# EAGLE design Monlock5x7_B (EAGLE 7.2.0)
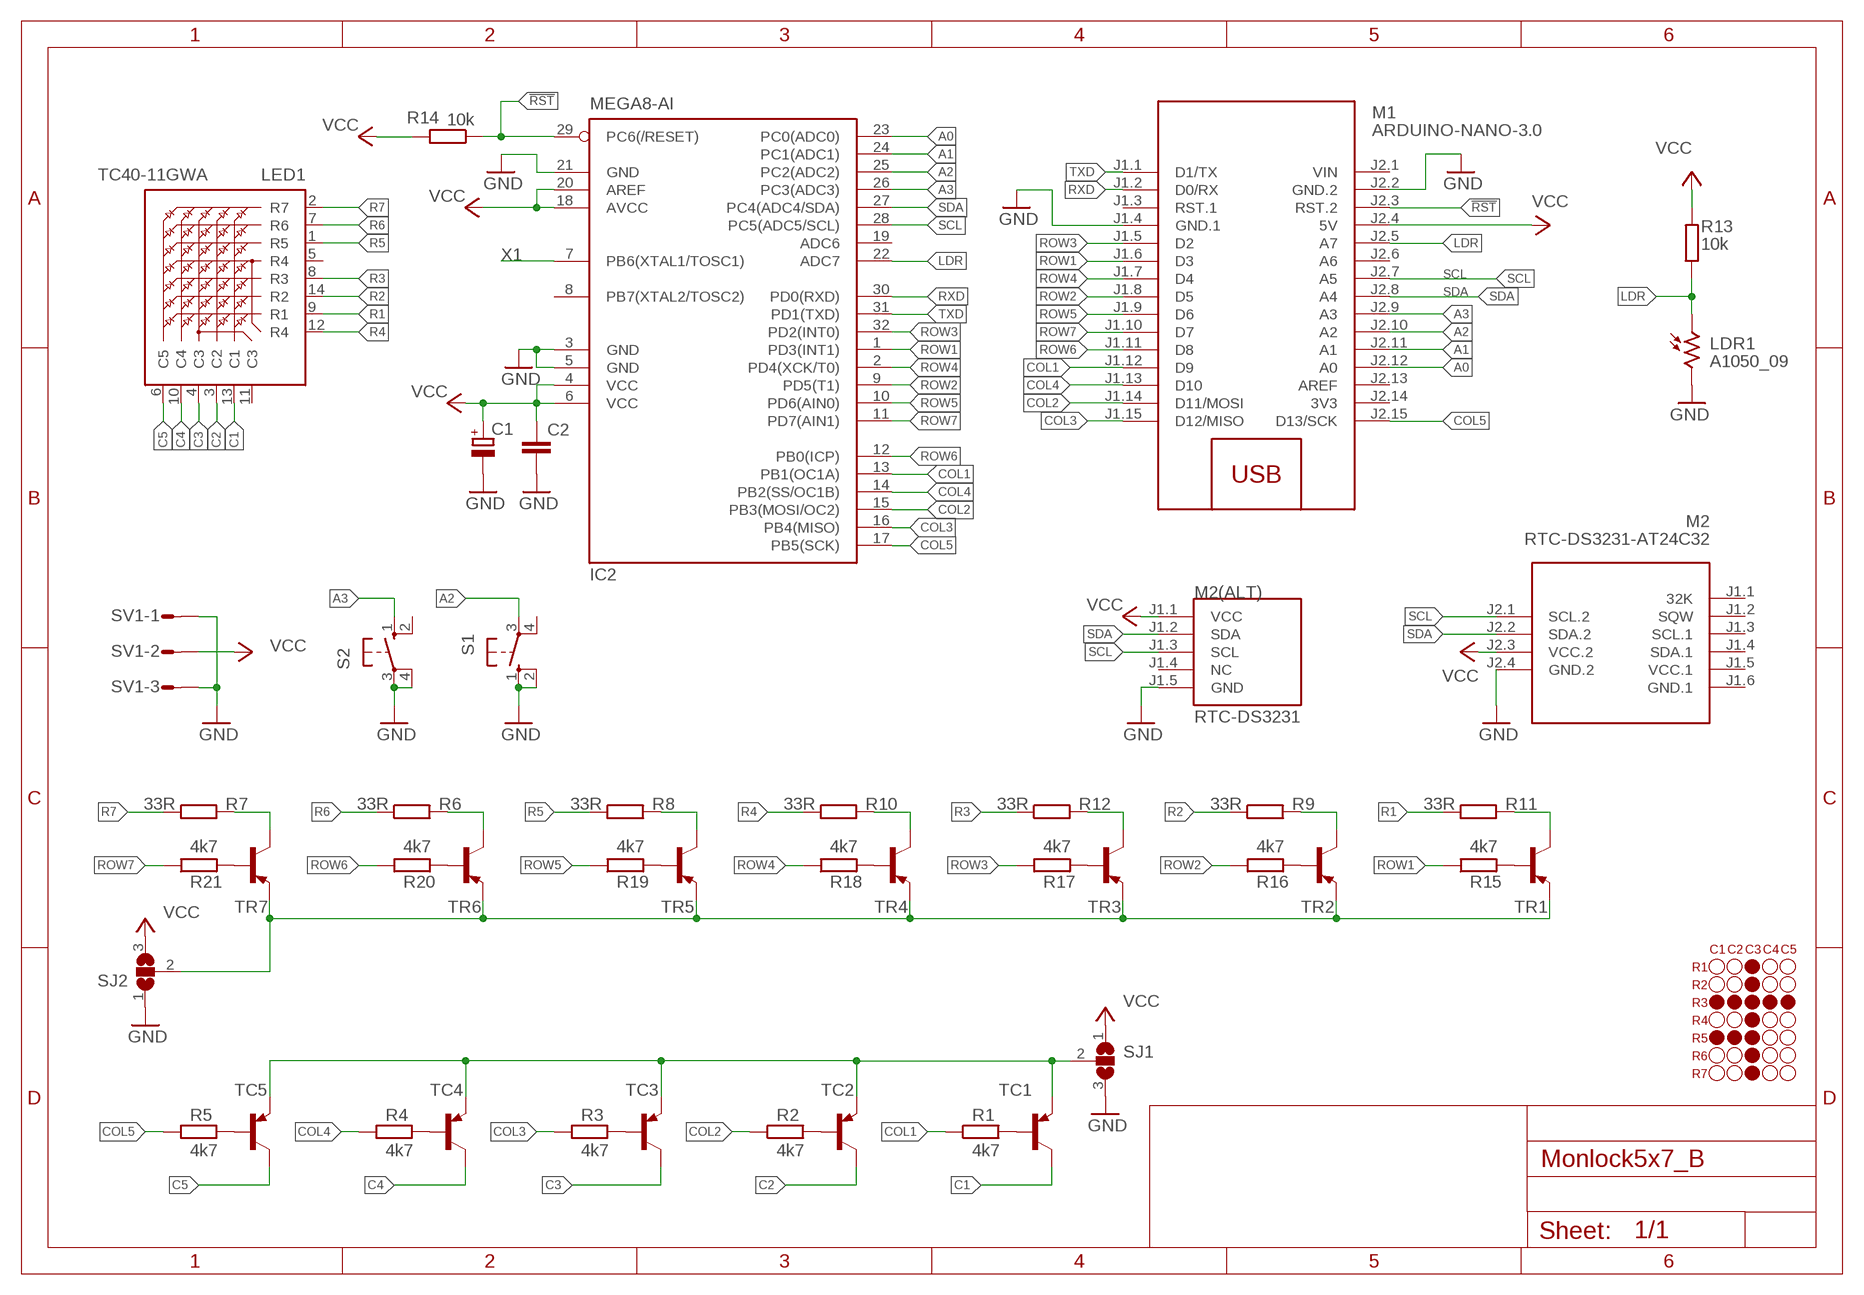
[diagram p0: schematic, sheet 1]

## Parts
C1  CPOL-EU153CLV-0605  [153CLV-0605]
C2  C-EUC0805K  [C0805K]
IC2  MEGA8-AI  [TQFP32-08]
LDR1  A1050_09  [T0-46-A10XX]
LED1  TC40-11GWA  [TC40-11GWA]
M1  ARDUINO-NANO-3.0  [ARDUINO-NANO-3.0]
M2  RTC-DS3231-AT24C32  [RTC-DS3231-AT24C32]
M2(ALT)  RTC-DS3231  [RTC-DS3231_SMALL]
R1  4k7  R-EU_0204/7  [0204/7]
R2  4k7  R-EU_0204/7  [0204/7]
R3  4k7  R-EU_0204/7  [0204/7]
R4  4k7  R-EU_0204/7  [0204/7]
R5  4k7  R-EU_0204/7  [0204/7]
R6  33R  R-EU_0204/7  [0204/7]
R7  33R  R-EU_0204/7  [0204/7]
R8  33R  R-EU_0204/7  [0204/7]
R9  33R  R-EU_0204/7  [0204/7]
R10  33R  R-EU_0204/7  [0204/7]
R11  33R  R-EU_0204/7  [0204/7]
R12  33R  R-EU_0204/7  [0204/7]
R13  10k  R-EU_0204/7  [0204/7]
R14  10k  R-EU_M0805  [M0805]
R15  4k7  R-EU_0204/7  [0204/7]
R16  4k7  R-EU_0204/7  [0204/7]
R17  4k7  R-EU_0204/7  [0204/7]
R18  4k7  R-EU_0204/7  [0204/7]
R19  4k7  R-EU_0204/7  [0204/7]
R20  4k7  R-EU_0204/7  [0204/7]
R21  4k7  R-EU_0204/7  [0204/7]
S1  40-XX  [B3F-40XX]
S2  40-XX  [B3F-40XX]
SJ1  SJ2W  [SJ_2]
SJ2  SJ2W  [SJ_2]
SV1  S03P  [S03P]
TC1  BC327-PNP-TO92-EBC  [TO92-EBC]
TC2  BC327-PNP-TO92-EBC  [TO92-EBC]
TC3  BC327-PNP-TO92-EBC  [TO92-EBC]
TC4  BC327-PNP-TO92-EBC  [TO92-EBC]
TC5  BC327-PNP-TO92-EBC  [TO92-EBC]
TR1  BC327-PNP-TO92-EBC  [TO92-EBC]
TR2  BC327-PNP-TO92-EBC  [TO92-EBC]
TR3  BC327-PNP-TO92-EBC  [TO92-EBC]
TR4  BC327-PNP-TO92-EBC  [TO92-EBC]
TR5  BC327-PNP-TO92-EBC  [TO92-EBC]
TR6  BC327-PNP-TO92-EBC  [TO92-EBC]
TR7  BC327-PNP-TO92-EBC  [TO92-EBC]

## Nets
!RST: IC2.29(PC6(/RESET)) M1.J2.3(RST.2) R14.1
A0: IC2.23(PC0(ADC0)) M1.J2.12(A0)
A1: IC2.24(PC1(ADC1)) M1.J2.11(A1)
A2: IC2.25(PC2(ADC2)) M1.J2.10(A2) S1.3(P)
A3: IC2.26(PC3(ADC3)) M1.J2.9(A3) S2.1(S)
C1: LED1.13(C1) TC1.C
C2: LED1.3(C2) TC2.C
C3: LED1.4(C3) TC3.C
C4: LED1.10(C4) TC4.C
C5: LED1.6(C5) TC5.C
CC1: R1.2 TC1.B
CC2: R2.2 TC2.B
CC3: R3.2 TC3.B
CC4: R4.2 TC4.B
CC5: R5.2 TC5.B
CC6: R15.2 TR1.B
COL1: IC2.13(PB1(OC1A)) M1.J1.12(D9) R1.1
COL2: IC2.15(PB3(MOSI/OC2)) M1.J1.14(D11/MOSI) R2.1
COL3: IC2.16(PB4(MISO)) M1.J1.15(D12/MISO) R3.1
COL4: IC2.14(PB2(SS/OC1B)) M1.J1.13(D10) R4.1
COL5: IC2.17(PB5(SCK)) M1.J2.15(D13/SCK) R5.1
GND: C1.- C2.2 IC2.3(GND) IC2.5(GND) IC2.21(GND) LDR1.2 M1.J1.4(GND.1) M1.J2.2(GND.2) M2(ALT).J1.5(GND) M2.J2.4(GND.2) S1.1(S) S1.2(S1) S2.3(P) S2.4(P1) SJ1.3 SJ2.1 SV1.1 SV1.3
LDR: IC2.22(ADC7) LDR1.1 M1.J2.5(A7) R13.1
N$6: SJ1.2 TC1.E TC2.E TC3.E TC4.E TC5.E
N$7: SJ2.2 TR1.E TR2.E TR3.E TR4.E TR5.E TR6.E TR7.E
N$8: R16.2 TR2.B
N$11: R17.2 TR3.B
N$12: R18.2 TR4.B
N$14: R19.2 TR5.B
N$15: R20.2 TR6.B
N$21: R21.2 TR7.B
N$22: R7.2 TR7.C
N$23: R6.2 TR6.C
N$24: R8.2 TR5.C
N$25: R10.2 TR4.C
N$26: R12.2 TR3.C
N$27: R9.2 TR2.C
N$28: R11.2 TR1.C
R1: LED1.9(R1) R11.1
R2: LED1.14(R2) R9.1
R3: LED1.8(R3) R12.1
R4: LED1.12(R4) R10.1
R5: LED1.1(R5) R8.1
R6: LED1.7(R6) R6.1
R7: LED1.2(R7) R7.1
ROW1: IC2.1(PD3(INT1)) M1.J1.6(D3) R15.1
ROW2: IC2.9(PD5(T1)) M1.J1.8(D5) R16.1
ROW3: IC2.32(PD2(INT0)) M1.J1.5(D2) R17.1
ROW4: IC2.2(PD4(XCK/T0)) M1.J1.7(D4) R18.1
ROW5: IC2.10(PD6(AIN0)) M1.J1.9(D6) R19.1
ROW6: IC2.12(PB0(ICP)) M1.J1.11(D8) R20.1
ROW7: IC2.11(PD7(AIN1)) M1.J1.10(D7) R21.1
RXD: IC2.30(PD0(RXD)) M1.J1.2(D0/RX)
SCL: IC2.28(PC5(ADC5/SCL)) M1.J2.7(A5) M2(ALT).J1.3(SCL) M2.J2.1(SCL.2)
SDA: IC2.27(PC4(ADC4/SDA)) M1.J2.8(A4) M2(ALT).J1.2(SDA) M2.J2.2(SDA.2)
TXD: IC2.31(PD1(TXD)) M1.J1.1(D1/TX)
VCC: C1.+ C2.1 IC2.4(VCC) IC2.6(VCC) IC2.18(AVCC) IC2.20(AREF) M1.J2.4(5V) M2(ALT).J1.1(VCC) M2.J2.3(VCC.2) R13.2 R14.2 SJ1.1 SJ2.3 SV1.2
X1: IC2.7(PB6(XTAL1/TOSC1))
Unconnected: IC2.8(PB7(XTAL2/TOSC2)) IC2.19(ADC6) LED1.5(R4) LED1.11(C3) M1.J1.3(RST.1) M1.J2.6(A6) M1.J2.13(AREF) M2(ALT).J1.4(NC) M2.J1.1(32K) M2.J1.2(SQW) M2.J1.3(SCL.1) M2.J1.4(SDA.1) S1.4(P1) S2.2(S1)

## Notes on the sheet
- C1 | C2 | C3 | C4 | C5
- R1
- R2
- R3
- R4
- R5
- R6
- R7

## Power pins joined to a net without a drawn wire
3V3: M1.J2.14(3V3)
GND.1: M2.J1.6(GND.1)
VCC.1: M2.J1.5(VCC.1)
VIN: M1.J2.1(VIN)

## Library data of the parts
C1 = rcl:CPOL-EU: POLARIZED CAPACITOR, European symbol
C2 = rcl:C-EU: CAPACITOR, European symbol
IC2 = atmel:MEGA8: MICROCONTROLLER 8 Kbytes FLASH, 1 kbytes SRAM, 512 bytes EEPROM, USART, 6-channel 10 bit ADC, 2-channel 8 bit ADC Pin compatible with Atmega48, ATMega88, ATMega168 Source: avr.lbr; MPN: ATMEGA8-16AU; OC_FARNELL: 9171371; OC_NEWARK: 73M8863
LDR1 = photo-elements:A10: Sensor Robust Light Sensing Applications Outdoor Light Sensing Application Source: http://optoelectronics.perkinelmer.com/content/Datasheets/DTS_PhotocellsA1050.pdf
LED1 = display-5x7-4inch:TC40-11GWA: 100mm (4.0 INCH) 5x7 DOT MATRIX DISPLAY https://www.kingbrightusa.com/images/catalog/SPEC/TC40-11GWA.pdf; OC_FARNELL: unknown; OC_NEWARK: unknown
M1 = diy-modules:ARDUINO-NANO-3.0: Arduino Nano 3.0 and compatible devices More details available here: https://www.arduino.cc/en/Main/ArduinoBoardNano Click here to find device on ebay.com <http://www.ebay.com/sch/arduino+nano>
M2 = diy-modules:RTC-DS3231-AT24C32: RTC Module with Battery and EEPROM based on DS3231 and AT24C32 chips Tutorial can be found here: https://edwardmallon.wordpress.com/2014/05/21/using-a-cheap-3-ds3231-rtc-at24c32-eeprom-from-ebay/ Click here to find device on ebay.com <http://www.ebay.com/sch/DS3231+AT24C32+module>
M2(ALT) = RTC:RTC-DS3231
R1-R21 = rcl:R-EU_: RESISTOR, European symbol
S1 S2 = switch-omron:40-XX: OMRON SWITCH; MF: OMRON COMPONENTS USA; MPN: B3F-4000; OC_FARNELL: 176434; OC_NEWARK: 36K3105
SJ1 SJ2 = jumper:SJ2W: SMD solder JUMPER
SV1 = con-amp-mt:S03P: AMP MT CONNECTOR; OC_FARNELL: unknown; OC_NEWARK: unknown
TC1-TC5 TR1-TR7 = transistor:*-PNP-: PNP Transistror

## Board
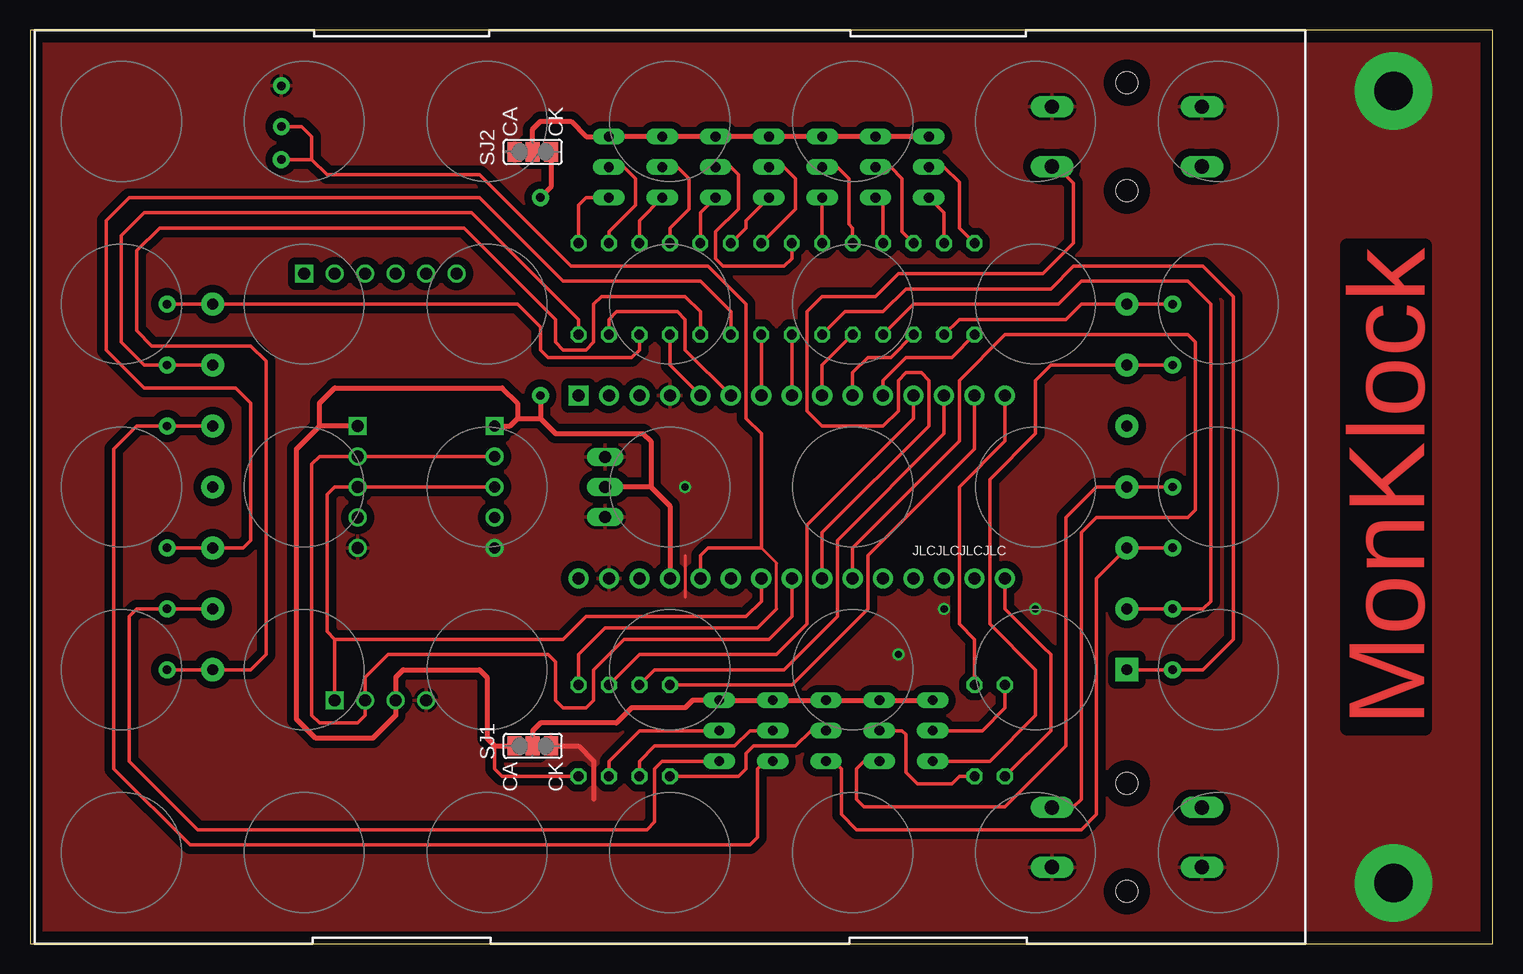
[diagram p1: board, top side]
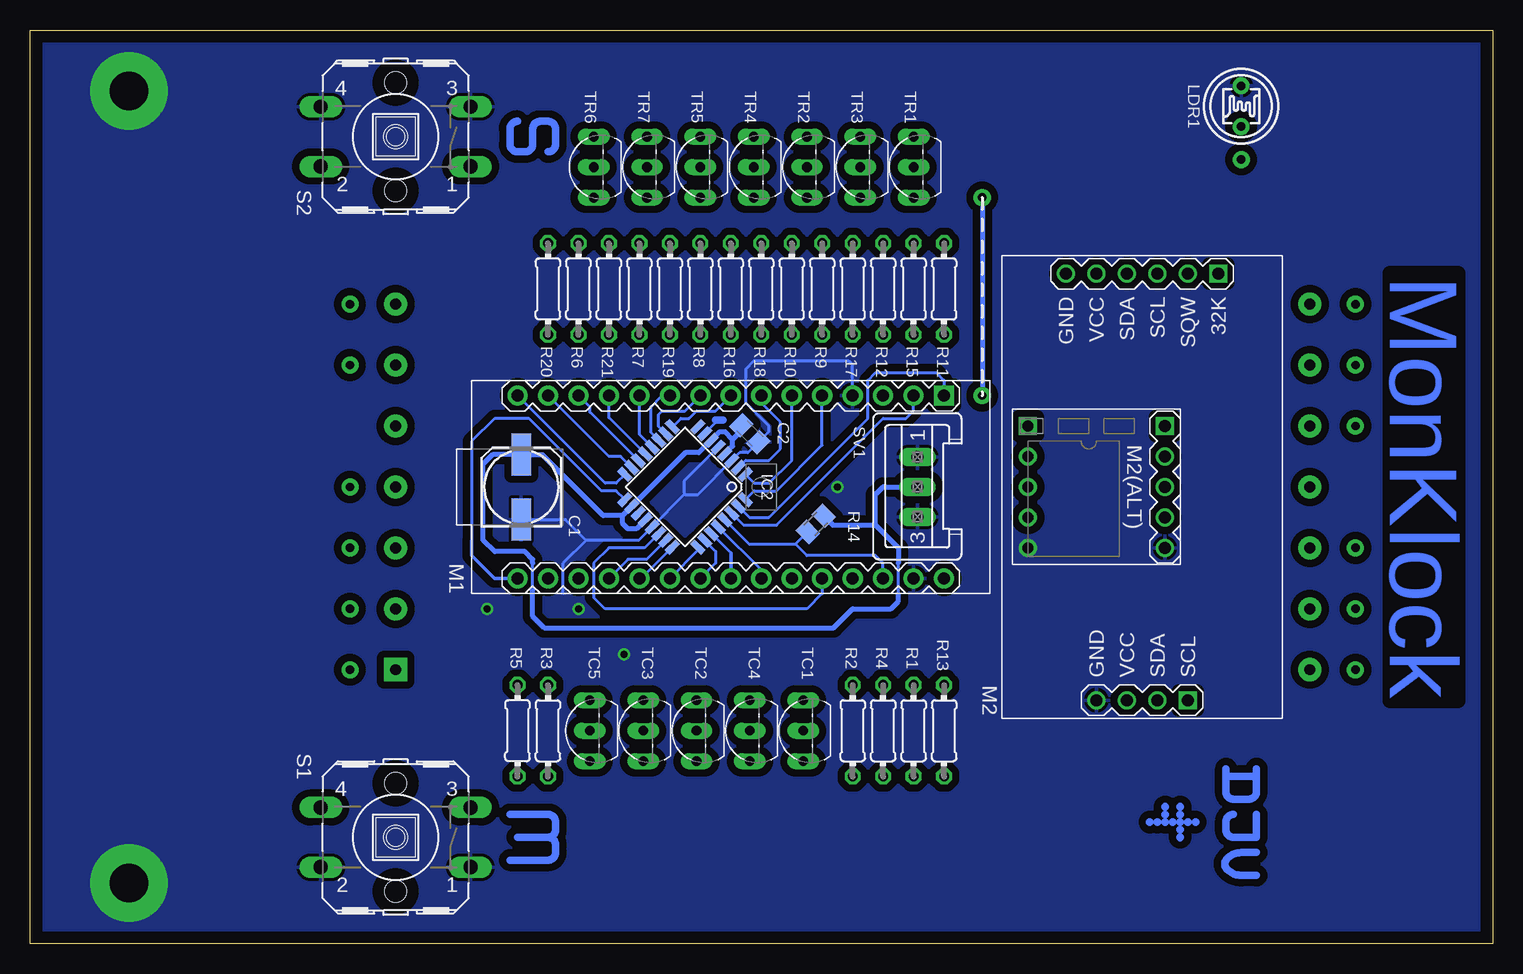
[diagram p2: board, bottom side, seen from below]

Size 121.92 x 76.2 mm. Coordinates in mm from the lower left corner, seen from the top.
Outline: 0,0 121.92,0 121.92,76.2 0,76.2 0,0
Copper layers (1*16): Top 0.035mm / dielectric 1.5mm / Bottom 0.035mm
Design rules "default *": minimum track width 10mil, minimum drill 24mil, track to track 8mil, track to pad 8mil, pad to pad 8mil, via to via 8mil, smd to smd 8mil, copper to edge 40mil, drill to drill 8mil, minimum pad ring 10mil, minimum via ring 8mil, stop-mask expansion 4mil, vias tented up to drill 24mil, thermal gap 10mil

### Footprints (pad centres in the part's own frame; a part is rotated, then mirrored left to right if it is on the bottom)
153CLV-0605 = smd 3.5 x 1.6: + 2.7,0; - -2.7,0
C0805K = smd 1.3 x 1.6: 1 -1,0; 2 1,0
TQFP32-08 = smd 1.27 x 0.559: 1 -4.293,2.8; 2 -4.293,2; 3 -4.293,1.2; 4 -4.293,0.4; 5 -4.293,-0.4; 6 -4.293,-1.2; 7 -4.293,-2; 8 -4.293,-2.8; 17 4.293,-2.8; 18 4.293,-2; 19 4.293,-1.2; 20 4.293,-0.4; 21 4.293,0.4; 22 4.293,1.2; 23 4.293,2; 24 4.293,2.8 | smd 0.559 x 1.27: 9 -2.8,-4.293; 10 -2,-4.293; 11 -1.2,-4.293; 12 -0.4,-4.293; 13 0.4,-4.293; 14 1.2,-4.293; 15 2,-4.293; 16 2.8,-4.293; 25 2.8,4.293; 26 2,4.293; 27 1.2,4.293; 28 0.4,4.293; 29 -0.4,4.293; 30 -1.2,4.293; 31 -2,4.293; 32 -2.8,4.293
T0-46-A10XX = drill 0.7 pad 1.4: 1 -1.7,0; 2 1.7,0
TC40-11GWA = drill 0.9 pad 1.93 square: 1 -15.24,-38.1 | drill 0.9 pad 1.93: 2 -10.16,-38.1; 3 -5.08,-38.1; 4 0,-38.1; 5 5.08,-38.1; 6 10.16,-38.1; 7 15.24,-38.1; 8 15.24,38.1; 9 10.16,38.1; 10 5.08,38.1; 11 0,38.1; 12 -5.08,38.1; 13 -10.16,38.1; 14 -15.24,38.1
ARDUINO-NANO-3.0 = drill 1 pad 1.676 square: J1.1 17.78,7.62 | drill 1 pad 1.676: J1.2 15.24,7.62; J1.3 12.7,7.62; J1.4 10.16,7.62; J1.5 7.62,7.62; J1.6 5.08,7.62; J1.7 2.54,7.62; J1.8 0,7.62; J1.9 -2.54,7.62; J1.10 -5.08,7.62; J1.11 -7.62,7.62; J1.12 -10.16,7.62; J1.13 -12.7,7.62; J1.14 -15.24,7.62; J1.15 -17.78,7.62; J2.1 17.78,-7.62; J2.2 15.24,-7.62; J2.3 12.7,-7.62; J2.4 10.16,-7.62; J2.5 7.62,-7.62; J2.6 5.08,-7.62; J2.7 2.54,-7.62; J2.8 0,-7.62; J2.9 -2.54,-7.62; J2.10 -5.08,-7.62; J2.11 -7.62,-7.62; J2.12 -10.16,-7.62; J2.13 -12.7,-7.62; J2.14 -15.24,-7.62; J2.15 -17.78,-7.62
RTC-DS3231-AT24C32 = drill 1 square: J1.1 -17.78,6.35; J2.1 17.78,3.81 | drill 1: J1.2 -17.78,3.81; J1.3 -17.78,1.27; J1.4 -17.78,-1.27; J1.5 -17.78,-3.81; J1.6 -17.78,-6.35; J2.2 17.78,1.27; J2.3 17.78,-1.27; J2.4 17.78,-3.81
RTC-DS3231_SMALL = drill 1 square: J1.1 -5.08,6.35 | drill 1: J1.2 -2.54,6.35; J1.3 0,6.35; J1.4 2.54,6.35; J1.5 5.08,6.35
0204/7 = drill 0.813 octagon: 1 -3.81,0; 2 3.81,0
M0805 = smd 1.3 x 1.6: 1 -0.95,0; 2 0.95,0
B3F-40XX = drill 1.194 long: 1 -6.248,2.489; 2 6.248,2.489; 3 -6.248,-2.489; 4 6.248,-2.489 | hole 1.803: 0,-4.496; 0,4.496
SJ_2 = smd 1.168 x 1.6: 1 -1.524,0; 2 0,0; 3 1.524,0
S03P = drill 1.016 long: 1 2.5,0; 2 0,0; 3 -2.5,0
TO92-EBC = drill 0.813 long: B 0,-1.27; C 2.54,-1.27; E -2.54,-1.27

### Placement (x,y rotation side)
C1  80.96,38.1 90 bottom
C2  61.91,42.55 315 bottom
IC2  67.31,38.1 225 bottom
LDR1  20.95,69.85 90 bottom
LED1  53.34,38.1 90 top
M1  63.5,38.1 0 bottom
M2  29.21,38.1 270 bottom
M2(ALT)  33.66,38.1 270 bottom
R1  48.26,17.78 270 bottom
R2  53.34,17.78 270 bottom
R3  78.74,17.78 270 bottom
R4  50.8,17.78 270 bottom
R5  81.28,17.78 90 bottom
R6  76.2,54.61 90 bottom
R7  71.12,54.61 90 bottom
R8  66.04,54.61 90 bottom
R9  55.88,54.61 90 bottom
R10  58.42,54.61 90 bottom
R11  45.72,54.61 90 bottom
R12  50.8,54.61 90 bottom
R13  45.72,17.78 270 bottom
R14  56.42,35.02 45 bottom
R15  48.26,54.61 90 bottom
R16  63.5,54.61 90 bottom
R17  53.34,54.61 90 bottom
R18  60.96,54.61 90 bottom
R19  68.58,54.61 90 bottom
R20  78.74,54.61 90 bottom
R21  73.66,54.61 90 bottom
S1  91.44,8.89 180 bottom
S2  91.44,67.31 180 bottom
SJ1  41.91,16.51 0 top
SJ2  41.91,66.04 0 top
SV1  47.94,38.1 90 bottom
TC1  56.2,17.78 270 bottom
TC2  65.09,17.78 270 bottom
TC3  69.53,17.78 270 bottom
TC4  60.64,17.78 270 bottom
TC5  73.98,17.78 270 bottom
TR1  46.99,64.77 270 bottom
TR2  55.88,64.77 270 bottom
TR3  51.44,64.77 270 bottom
TR4  60.33,64.77 270 bottom
TR5  64.77,64.77 270 bottom
TR6  73.66,64.77 270 bottom
TR7  69.22,64.77 270 bottom

### Tracks (layer width: path | path; a pad name or v marks a point on that pad's centre or on a via)
!RST
  Bottom 0.254: IC2.29 61.98,33.34 58.1,33.34 | 58.1,33.34 R14.1 | R14.1 | M1.J2.3 50.8,31.75 51.44,32.38 57.15,32.38 58.1,33.34
A0
  Bottom 0.254: IC2.23 70.51,32.07 72.07,32.07 M1.J2.12
A1
  Bottom 0.254: IC2.24 70.97,30.48 M1.J2.11
A2
  Top 0.305: M1.J2.10 68.58,33.02 77.47,41.91 77.47,46.99 81.28,50.8 96.52,50.8 97.16,50.16 97.16,36.2 96.52,35.56 88.9,35.56 87.63,34.29 87.63,12.06 86.94,11.38 S1.3
  Bottom 0.254: IC2.25 66.25,32.8 M1.J2.10
A3
  Top 0.305: M1.J2.9 66.04,34.29 74.93,43.18 74.93,46.99 74.3,47.62 73.02,47.62 72.39,46.99 72.39,44.45 71.12,43.18 66.04,43.18 64.77,44.45 64.77,52.7 66.04,53.98 70.48,53.98 72.39,55.88 84.45,55.88 86.99,58.42 86.99,63.45 85.62,64.82 S2.1
  Bottom 0.254: IC2.26 64.77,32.73 64.77,31.75 M1.J2.9
C1  (via drill 0.7 pad 1.42)
  Top 0.305: LED1.13 v11.43,27.94 8.89,27.94 8.25,27.3 8.25,15.24 13.97,9.53 51.44,9.53 52.07,10.16 52.07,14.61 52.71,15.24 TC1.C
C2  (via drill 0.7 pad 1.42)
  Top 0.305: TC2.C 66.99,15.24 67.63,14.61 67.63,10.79 68.9,9.53 87.63,9.53 88.9,10.79 88.9,30.48 LED1.3 v95.25,33.02
C3  (via drill 0.7 pad 1.42)
  Top 0.305: TC3.C 69.53,15.24 68.9,14.61 68.9,12.06 69.53,11.43 81.28,11.43 86.36,16.51 86.36,35.56 88.9,38.1 LED1.4 v95.25,38.1
C4  (via drill 0.7 pad 1.42)
  Top 0.305: LED1.10 v11.43,43.18 8.89,43.18 6.98,41.27 6.98,14.61 13.34,8.26 60.01,8.26 60.64,8.89 60.64,14.61 61.28,15.24 TC4.C
C5  (via drill 0.7 pad 1.42)
  Top 0.305: TC5.C 80.01,15.24 83.82,19.05 83.82,22.86 80.01,26.67 80.01,38.73 83.82,42.55 83.82,46.99 85.09,48.26 LED1.6 v95.25,48.26
CC1
  Top 0.305: TC1.B 52.07,17.78 50.8,17.78 48.26,15.24 R1.2
CC2
  Top 0.305: TC2.B 65.09,17.78 63.82,16.51 60.33,16.51 59.69,15.88 59.69,14.61 59.05,13.97 R2.2
CC3
  Top 0.305: TC3.B 72.71,17.78 73.02,17.46 73.02,14.29 73.98,13.34 76.83,13.34 77.47,13.97 R3.2
CC4
  Top 0.305: TC4.B 60.01,17.78 58.74,16.51 52.07,16.51 50.8,15.24 R4.2
CC5
  Top 0.305: R5.2 81.28,19.68 79.38,17.78 TC5.B
CC6
  Top 0.305: R15.2 48.26,59.37 50.48,61.59 50.48,63.82 49.53,64.77 TR1.B
COL1
  Top 0.305: R1.1 50.8,24.13 57.15,24.13 62.23,24.13 64.77,26.67 64.77,34.92 73.66,43.81 M1.J1.12
  Bottom 0.254: IC2.13 73.66,43.88 M1.J1.12
COL2
  Top 0.305: R2.1 63.5,21.59 69.85,27.94 69.85,32.38 78.74,41.27 M1.J1.14
  Bottom 0.254: IC2.15 72.68,40.64 73.66,40.64 M1.J1.14
COL3
  Top 0.305: R3.1 78.74,25.4 77.47,26.67 77.47,38.1 81.28,41.91 M1.J1.15
  Bottom 0.254: IC2.16 73.06,38.42 73.98,38.42 M1.J1.15
COL4
  Top 0.305: M1.J1.13 76.2,42.55 67.31,33.66 67.31,27.3 62.87,22.86 60.96,22.86 52.07,22.86 R4.1
  Bottom 0.254: IC2.14 75.25,44.34 75.25,44.77 M1.J1.13
COL5
  Top 0.305: M1.J2.15 81.28,27.94 84.45,24.77 85.09,24.13 85.09,17.78 R5.1
  Bottom 0.254: 85.09,33.66 85.09,41.91 83.18,43.81 80.33,43.81 74.3,37.78 73.06,37.78 IC2.17
  Bottom 0.305: 85.09,33.66 85.09,32.38 83.18,30.48 M1.J2.15
GND  (via drill 0.6, 0.9 pad 1.52, 3.2 pad 6.45)
  Top 0.254: 54.61,32.38 54.61,28.89
  Top 0.406: SJ1.3 45.72,16.51 46.99,15.24 46.99,12.06
  Bottom 0.254: 67.38,37.47 66.25,37.47 IC2.3 62.76,40.96 62.09,40.96 C2.2 60.33,42.72 60.33,43.18 62.23,45.09 62.23,47.94 61.59,48.58 53.66,48.58 53.34,48.26 M1.J1.4 | 77.47,29.21 77.47,31.75 75.56,33.66 | 75.56,33.66 71.19,33.66 IC2.21 67.38,37.47 | C1.- 77.31,35.4 75.56,33.66 | IC2.5 67.38,38.6 67.38,37.47
  other vias: 38.73,33.02 76.2,27.94 83.82,27.94 72.39,24.13 113.66,5.08 113.66,71.12 54.61,38.1
  pour Top (isolate 0.61): 0,0 0,76.2 121.92,76.2 121.92,0
  pour Bottom (isolate 0.61): 0,0 0,76.2 121.92,76.2 121.92,0
LDR  (via drill 0.7 pad 1.42)
  Top 0.254: 62.23,27.94 62.23,31.75 60.96,33.02
  Top 0.305: M1.J2.5 55.88,32.38 56.52,33.02 60.96,33.02 60.96,42.55 59.69,43.81 59.69,53.34 56.52,56.52 45.09,56.52 37.47,64.14 24.77,64.14 23.5,65.41 | 62.23,27.94 60.64,26.35 47.94,26.35 45.72,24.13 R13.1 | v20.95,65.41 23.5,65.41 | LDR1.1 22.66,68.15 23.5,67.31 23.5,65.41
  Bottom 0.254: IC2.22 70.69,33.02 73.66,33.02 74.93,31.75 74.93,28.89 73.98,27.94 57.15,27.94 55.88,29.21 M1.J2.5
N$3
  Bottom 0.61: 81.28,68.58 arc-90 81.91,67.94 81.91,66.67 arc-90 81.28,66.04 80.64,66.04 arc-90 80.01,66.67 80.01,67.94 arc90 79.38,68.58 78.74,68.58 arc90 78.11,67.94 78.11,66.67 arc90 78.74,66.04
N$6
  Top 0.406: TC5.E TC3.E TC2.E TC4.E TC1.E 55.25,20.32 54.61,19.68 50.16,19.68 48.9,18.41 42.55,18.41 41.91,17.78 SJ1.2
N$7
  Top 0.406: SJ2.2 41.91,67.94 42.55,68.58 45.09,68.58 46.35,67.31 TR1.E TR3.E TR2.E TR4.E TR5.E TR7.E TR6.E
N$8
  Top 0.305: TR2.B 58.42,64.77 59.05,64.14 59.05,61.28 57.15,59.37 57.15,57.15 57.79,56.52 62.87,56.52 63.5,57.15 R16.2
N$11
  Top 0.305: R17.2 53.34,59.69 54.93,61.28 54.93,63.82 53.98,64.77 TR3.B
N$12
  Top 0.305: R18.2 63.82,61.28 63.82,63.82 62.87,64.77 TR4.B
N$13
  Bottom 0.61: 81.91,10.79 78.74,10.79 arc90 78.11,10.16 78.11,9.53 arc90 78.74,8.89 | 81.91,6.99 78.74,6.99 arc-90 78.11,7.62 78.11,8.26 arc-90 78.74,8.89 | 78.74,8.89 81.28,8.89
N$14
  Top 0.305: TR5.B 67.31,64.77 68.26,63.82 68.26,60.01 68.58,59.69 R19.2
N$15
  Top 0.305: R20.2 77.47,59.69 77.47,63.5 76.2,64.77 TR6.B
N$17
  Bottom 0.61: 19.69,14.61 19.69,13.97 | 19.69,13.97 19.69,12.7 arc90 20.32,12.06 21.59,12.06 arc90 22.23,12.7 22.23,13.97 | 22.23,13.97 22.23,14.61 | 19.69,13.97 22.23,13.97
N$18
  Bottom 0.61: 19.69,10.79 19.69,8.89 21.59,8.89 arc90 22.23,9.53 22.23,10.16 arc90 21.59,10.79
N$19
  Bottom 0.61: 19.69,5.71 20.95,5.71 arc53 22.23,6.35 arc74 22.23,6.99 arc53 20.95,7.62 19.69,7.62
N$21
  Top 0.305: R21.2 72.71,59.37 72.71,63.82 71.75,64.77 TR7.B
N$22
  Top 0.305: R7.2 71.12,61.59 TR7.C
N$23
  Top 0.305: R6.2 76.2,60.96 TR6.C
N$24
  Top 0.305: TR5.C R8.2
N$25
  Top 0.305: R10.2 59.69,59.69 59.69,60.33 TR4.C
N$26
  Top 0.305: R12.2 50.8,60.33 TR3.C
N$27
  Top 0.305: R9.2 55.88,60.96 TR2.C
N$28
  Top 0.305: TR1.C 46.35,62.23 45.72,61.59 R11.2
N$31  (via drill 0.9 pad 1.52)
  other vias: 38.73,35.56
R1  (via drill 0.7 pad 1.42)
  Top 0.305: LED1.9 v11.43,48.26 9.53,48.26 7.62,50.16 7.62,55.88 7.62,59.05 9.53,60.96 12.7,60.96 36.83,60.96 45.72,52.07 R11.1
R2  (via drill 0.7 pad 1.42)
  Top 0.305: R9.1 55.88,52.7 54.61,53.98 47.62,53.98 46.99,53.34 46.99,50.16 46.35,49.53 44.45,49.53 43.81,50.16 43.81,52.07 36.2,59.69 10.79,59.69 8.89,57.78 8.89,51.12 10.16,49.85 18.41,49.85 19.69,48.58 19.69,27.3 19.69,24.13 18.41,22.86 LED1.14 v11.43,22.86
R3  (via drill 0.7 pad 1.42)
  Top 0.305: R12.1 50.8,49.53 50.16,48.9 43.18,48.9 42.55,49.53 42.55,51.44 40.64,53.34 LED1.8 v11.43,53.34
R4  (via drill 0.7 pad 1.42)
  Top 0.305: R10.1 58.42,52.7 55.88,55.24 44.45,55.24 37.47,62.23 12.07,62.23 8.25,62.23 6.35,60.33 6.35,56.52 6.35,49.53 9.53,46.35 17.14,46.35 18.41,45.09 18.41,33.66 17.78,33.02 LED1.12 v11.43,33.02
R5  (via drill 0.7 pad 1.42)
  Top 0.305: LED1.1 v95.25,22.86 97.79,22.86 100.33,25.4 100.33,53.98 97.79,56.52 86.99,56.52 85.09,54.61 73.02,54.61 71.12,52.7 67.94,52.7 R8.1
R6  (via drill 0.7 pad 1.42)
  Top 0.305: R6.1 77.47,52.07 86.36,52.07 87.63,53.34 LED1.7 v95.25,53.34
R7  (via drill 0.7 pad 1.42)
  Top 0.305: LED1.2 v95.25,27.94 97.79,27.94 98.42,28.57 98.42,53.34 96.52,55.24 87.63,55.24 85.72,53.34 73.66,53.34 R7.1
ROW1
  Top 0.305: M1.J1.6 54.61,49.53 54.61,52.07 53.98,52.7 48.9,52.7 48.26,52.07 R15.1
  Bottom 0.254: M1.J1.6 58.42,40.32 60.33,38.42 61.56,38.42 IC2.1
ROW2
  Top 0.305: M1.J1.8 R16.1
  Bottom 0.254: IC2.9 67.67,43.81 66.99,43.81 66.36,44.45 64.77,44.45 M1.J1.8
ROW3
  Top 0.305: R17.1 53.34,48.26 M1.J1.5
  Bottom 0.254: IC2.32 61.56,37.78 59.69,37.78 55.88,41.59 M1.J1.5
ROW4
  Top 0.305: R18.1 M1.J1.7
  Bottom 0.254: IC2.2 62.26,40.32 60.33,40.32 59.37,41.27 59.37,43.5 60.96,45.09 M1.J1.7
ROW5
  Top 0.305: M1.J1.9 66.04,48.26 R19.1
  Bottom 0.254: IC2.10 69.53,43.15 69.53,44.13 69.22,44.45 67.31,44.45 M1.J1.9
ROW6
  Top 0.305: M1.J1.11 71.12,46.99 73.02,48.9 76.83,48.9 R20.1
  Bottom 0.254: IC2.12 71.12,42.48 M1.J1.11
ROW7
  Top 0.305: M1.J1.10 68.58,47.62 69.85,48.9 71.75,48.9 R21.1
  Bottom 0.254: IC2.11 70.17,42.66 70.17,44.77 69.22,45.72 M1.J1.10
RXD
  Bottom 0.254: IC2.30 62.44,34.92 59.69,34.92 50.8,43.81 48.9,43.81 48.26,44.45 M1.J1.2
SCL  (via drill 0.9 pad 1.52)
  Top 0.305: M2.J2.1 25.4,25.4 | 25.4,25.4 44.45,25.4 46.35,27.3 59.69,27.3 60.96,28.57 M1.J2.7 | 25.4,25.4 24.77,26.04 24.77,37.47 25.4,38.1 M2(ALT).J1.3 v38.73,38.1
  Bottom 0.254: IC2.28 60.96,31.18
  Bottom 0.305: 60.96,31.18 M1.J2.7
SDA  (via drill 0.9 pad 1.52)
  Top 0.305: M1.J2.8 63.5,27.3 61.59,25.4 49.53,25.4 46.99,22.86 46.99,20.32 46.35,19.68 44.45,19.68 43.81,20.32 43.81,23.5 43.18,24.13 29.84,24.13 27.94,22.23 M2.J2.2 27.94,19.05 27.3,18.41 24.13,18.41 23.5,19.05 23.5,40.01 24.13,40.64 M2(ALT).J1.2 v38.73,40.64
  Bottom 0.254: IC2.27 63.5,32.59
  Bottom 0.305: 63.5,32.59 M1.J2.8
TXD
  Bottom 0.254: IC2.31 61.94,35.56 60.33,35.56 52.07,43.81 52.07,46.99 51.44,47.62 46.35,47.62 45.72,46.99 M1.J1.1
VCC  (via drill 0.7 pad 1.42, 0.9 pad 1.52)
  Top 0.305: R13.2 39.37,13.97 38.73,14.61 38.73,16.51
  Top 0.406: 24.13,43.18 22.23,41.27 22.23,18.73 23.81,17.14 28.58,17.14 30.48,19.05 M2.J2.3 30.48,22.23 31.12,22.86 37.47,22.86 38.1,22.23 38.1,17.14 38.73,16.51 SJ1.1 | 24.13,43.18 24.13,45.09 25.4,46.35 39.37,46.35 40.64,45.09 40.64,43.81 | 40.64,43.81 42.55,43.81 | v42.55,45.72 42.55,43.81 | 42.55,43.81 43.81,42.55 51.12,42.55 51.75,41.91 51.75,38.1 | M1.J2.4 53.34,36.51 51.75,38.1 | M2(ALT).J1.1 24.13,43.18 | 51.75,38.1 SV1.2 | SJ2.3 43.43,63.12 v42.55,62.23 | v38.73,43.18 40.01,43.18 40.64,43.81
  Bottom 0.254: 80.01,29.53 80.01,31.75 | 62.62,42.79 C2.1 | 49.53,29.21 49.53,31.75
  Bottom 0.406: IC2.4 63.34,41.5 63.34,42.07 | 63.34,42.07 63.98,42.7 64.4,42.7 IC2.6 66.15,40.96 67.28,40.96 IC2.18 72.52,35.72 | 72.52,35.72 74.14,35.72 79.22,40.8 C1.+ 83.34,40.8 84.14,40.01 84.14,33.66 83.18,32.7 80.64,32.7 80.01,32.07 80.01,31.75 | IC2.20 71.37,34.61 72.07,34.61 72.52,35.05 72.52,35.72 | 63.34,42.07 62.62,42.79 | v42.55,62.23 v42.55,45.72 | 80.01,29.53 80.01,27.3 79.06,26.35 54.93,26.35 53.34,27.94 50.16,27.94 49.53,28.57 49.53,29.21 | 51.44,34.92 49.53,33.02 49.53,31.75 | 51.44,34.92 51.44,37.47 50.8,38.1 SV1.2 | R14.2 54.99,34.92 51.44,34.92
X1
  Bottom 0.254: IC2.7 64.77,43.47 64.77,43.69
  Bottom 0.61: 64.14,43.69 64.77,43.69
(copper drawn outside any net)
  shapes: Bottom circle x13

### Text on the board
Top: MonKlock
Bottom: MonKlock
tPlace: CA | CK | JLCJLCJLCJLC | CA | CK
tStop: MonKlock
bStop: MonKlock